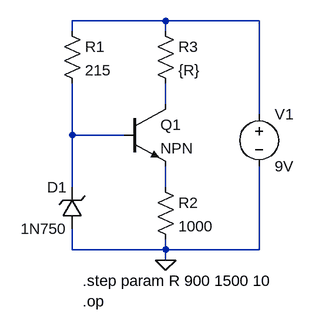
[diagram p0: schematic Exp3_PreLab_P2.asc]
Exp3_PreLab_P2.asc, the LTspice schematic file:
Version 4
SHEET 1 880 680
WIRE 304 -192 160 -192
WIRE 448 -192 304 -192
WIRE 160 -176 160 -192
WIRE 304 -176 304 -192
WIRE 304 -64 304 -96
WIRE 448 -48 448 -192
WIRE 160 -16 160 -96
WIRE 240 -16 160 -16
WIRE 160 64 160 -16
WIRE 304 64 304 32
WIRE 160 160 160 128
WIRE 304 160 304 144
WIRE 304 160 160 160
WIRE 448 160 448 32
WIRE 448 160 304 160
WIRE 304 176 304 160
FLAG 304 176 0
SYMBOL npn 240 -64 R0
SYMATTR InstName Q1
SYMBOL res 144 -192 R0
SYMATTR InstName R1
SYMATTR Value 215
SYMBOL res 288 48 R0
SYMATTR InstName R2
SYMATTR Value 1000
SYMBOL res 288 -192 R0
SYMATTR InstName R3
SYMATTR Value {R}
SYMBOL zener 176 128 R180
WINDOW 0 24 64 Left 2
WINDOW 3 24 0 Left 2
SYMATTR InstName D1
SYMATTR Value 1N750
SYMBOL voltage 448 -64 R0
SYMATTR InstName V1
SYMATTR Value 9V
TEXT 176 208 Left 2 !.step param R 900 1500 10\n.op

The netlist it stands for:
* Exp3_PreLab_P2.asc
Q1 N002 N003 N004 0 NPN
R1 N001 N003 215
R2 N004 0 1000
R3 N001 N002 {R}
D1 0 N003 1N750
V1 N001 0 9V
.model D D
.lib standard.dio
.model NPN NPN
.model PNP PNP
.lib standard.bjt
.step param R 900 1500 10
.op
.backanno
.end